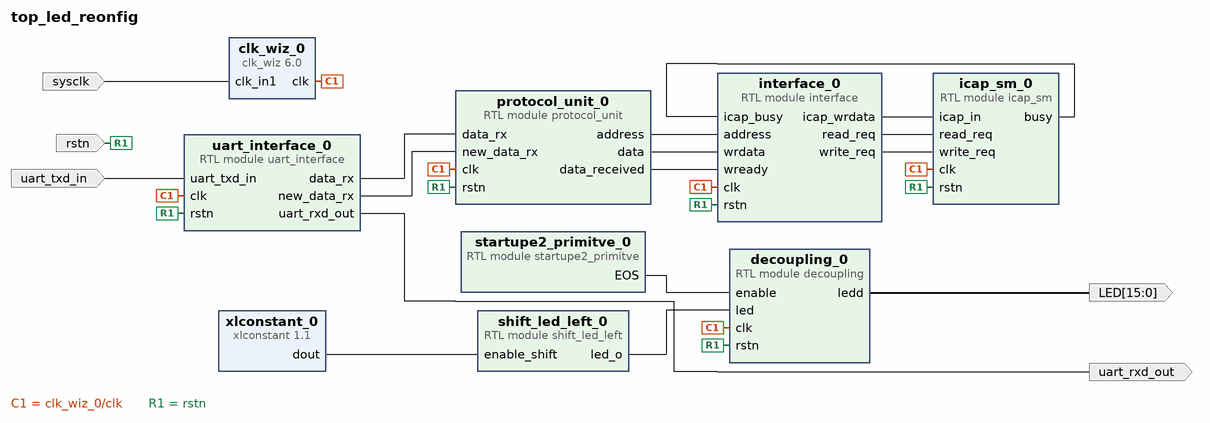
[diagram p0: block diagram of the top level]
# Vivado block design top_led_reonfig, xc7z010clg400-1, Vivado 2022.2
create_bd_design top_led_reonfig

create_bd_port -dir I -type rst rstn
create_bd_port -dir I -type clk sysclk
create_bd_port -dir I uart_txd_in
create_bd_port -dir O uart_rxd_out
create_bd_port -dir O -from 15 -to 0 LED

create_bd_cell -type module -reference decoupling decoupling_0
create_bd_cell -type module -reference uart_interface uart_interface_0
create_bd_cell -type module -reference icap_sm icap_sm_0
create_bd_cell -type module -reference interface interface_0
create_bd_cell -type module -reference startupe2_primitve startupe2_primitve_0
create_bd_cell -type module -reference protocol_unit protocol_unit_0
create_bd_cell -type ip -vlnv xilinx.com:ip:clk_wiz:6.0 clk_wiz_0
set_property -dict [list \
  CONFIG.CLKOUT1_JITTER 117.368 \
  CONFIG.CLKOUT1_PHASE_ERROR 88.161 \
  CONFIG.CLKOUT1_REQUESTED_PHASE 11.52 \
  CONFIG.CLK_OUT1_PORT clk \
  CONFIG.MMCM_CLKFBOUT_MULT_F 11.750 \
  CONFIG.MMCM_CLKOUT0_DIVIDE_F 11.750 \
  CONFIG.MMCM_CLKOUT0_PHASE 11.489 \
  CONFIG.USE_LOCKED false \
  CONFIG.USE_RESET false \
] [get_bd_cells clk_wiz_0]
create_bd_cell -type module -reference shift_led_left shift_led_left_0
create_bd_cell -type ip -vlnv xilinx.com:ip:xlconstant:1.1 xlconstant_0

# ---- connections ----

connect_bd_net [get_bd_pins clk_wiz_0/clk] \
  [get_bd_pins uart_interface_0/clk] [get_bd_pins protocol_unit_0/clk] [get_bd_pins icap_sm_0/clk] \
  [get_bd_pins interface_0/clk] [get_bd_pins decoupling_0/clk]
connect_bd_net -net clk_in1_0_1 [get_bd_ports sysclk] [get_bd_pins clk_wiz_0/clk_in1]
connect_bd_net [get_bd_pins decoupling_0/ledd] [get_bd_ports LED]
connect_bd_net [get_bd_pins icap_sm_0/busy] [get_bd_pins interface_0/icap_busy]
connect_bd_net [get_bd_pins interface_0/icap_wrdata] [get_bd_pins icap_sm_0/icap_in]
connect_bd_net [get_bd_pins interface_0/read_req] [get_bd_pins icap_sm_0/read_req]
connect_bd_net [get_bd_pins interface_0/write_req] [get_bd_pins icap_sm_0/write_req]
connect_bd_net [get_bd_pins protocol_unit_0/address] [get_bd_pins interface_0/address]
connect_bd_net [get_bd_pins protocol_unit_0/data] [get_bd_pins interface_0/wrdata]
connect_bd_net [get_bd_pins protocol_unit_0/data_received] [get_bd_pins interface_0/wready]
connect_bd_net -net rstn_0_1 [get_bd_ports rstn] \
  [get_bd_pins protocol_unit_0/rstn] [get_bd_pins uart_interface_0/rstn] [get_bd_pins icap_sm_0/rstn] \
  [get_bd_pins interface_0/rstn] [get_bd_pins decoupling_0/rstn]
connect_bd_net [get_bd_pins shift_led_left_0/led_o] [get_bd_pins decoupling_0/led]
connect_bd_net [get_bd_pins startupe2_primitve_0/EOS] [get_bd_pins decoupling_0/enable]
connect_bd_net [get_bd_pins uart_interface_0/data_rx] [get_bd_pins protocol_unit_0/data_rx]
connect_bd_net [get_bd_pins uart_interface_0/new_data_rx] [get_bd_pins protocol_unit_0/new_data_rx]
connect_bd_net [get_bd_pins uart_interface_0/uart_rxd_out] [get_bd_ports uart_rxd_out]
connect_bd_net -net uart_txd_in_0_1 [get_bd_ports uart_txd_in] [get_bd_pins uart_interface_0/uart_txd_in]
connect_bd_net [get_bd_pins xlconstant_0/dout] [get_bd_pins shift_led_left_0/enable_shift]

validate_bd_design
save_bd_design
